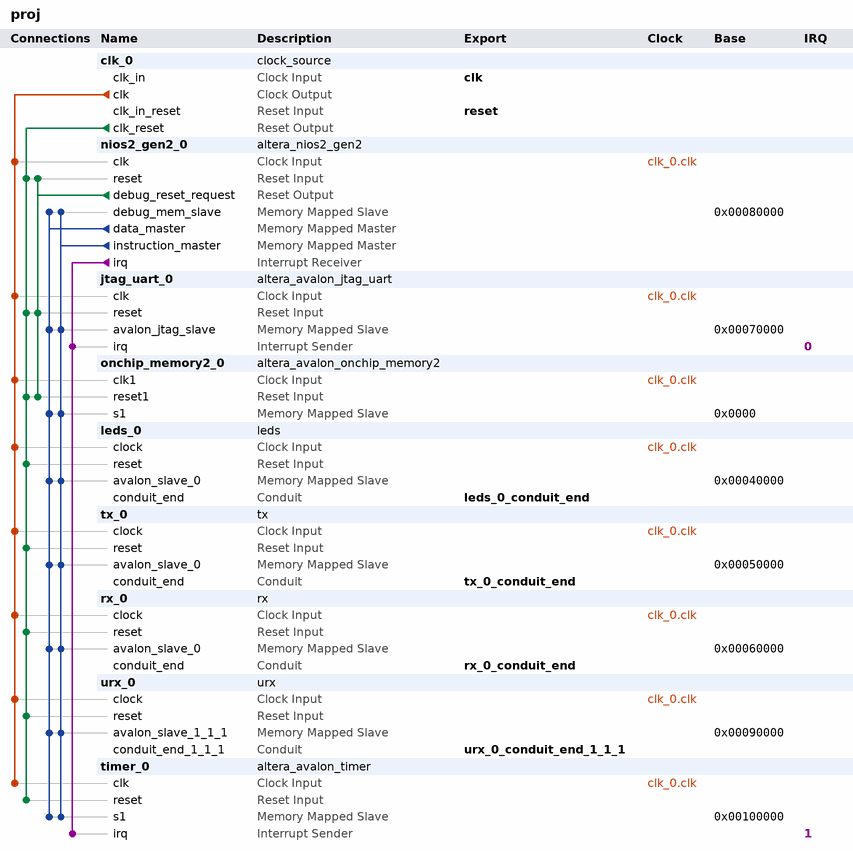
[diagram p0: system contents]
# Platform Designer (Qsys) system proj, Cyclone V 5CEBA4F23C7
# Parameters at their usual value, and those the tool derives, are not listed.
package require -exact qsys 18.1
create_system proj
set_project_property DEVICE_FAMILY {Cyclone V}
set_project_property DEVICE 5CEBA4F23C7

add_instance clk_0 clock_source 18.1
set_instance_parameter_value clk_0 clockFrequency 50000000

add_instance nios2_gen2_0 altera_nios2_gen2 18.1
set_instance_parameter_value nios2_gen2_0 dcache_size 2048
set_instance_parameter_value nios2_gen2_0 exceptionSlave onchip_memory2_0.s1
set_instance_parameter_value nios2_gen2_0 icache_size 4096
set_instance_parameter_value nios2_gen2_0 impl Tiny
set_instance_parameter_value nios2_gen2_0 resetSlave onchip_memory2_0.s1

add_instance jtag_uart_0 altera_avalon_jtag_uart 18.1
set_instance_parameter_value jtag_uart_0 simInteractiveOptions NO_INTERACTIVE_WINDOWS

add_instance onchip_memory2_0 altera_avalon_onchip_memory2 18.1
set_instance_parameter_value onchip_memory2_0 dataWidth 32
set_instance_parameter_value onchip_memory2_0 dualPort false
set_instance_parameter_value onchip_memory2_0 initMemContent true
set_instance_parameter_value onchip_memory2_0 initializationFileName onchip_mem.hex
set_instance_parameter_value onchip_memory2_0 memorySize 262114
set_instance_parameter_value onchip_memory2_0 useNonDefaultInitFile true

add_instance leds_0 leds 1.0

add_instance tx_0 tx 1.0

add_instance rx_0 rx 1.0

add_instance urx_0 urx 1.0

add_instance timer_0 altera_avalon_timer 18.1
set_instance_parameter_value timer_0 period 1
set_instance_parameter_value timer_0 periodUnits MSEC

# connections
add_connection clk_0.clk jtag_uart_0.clk clock
add_connection clk_0.clk leds_0.clock clock
add_connection clk_0.clk nios2_gen2_0.clk clock
add_connection clk_0.clk onchip_memory2_0.clk1 clock
add_connection clk_0.clk rx_0.clock clock
add_connection clk_0.clk timer_0.clk clock
add_connection clk_0.clk tx_0.clock clock
add_connection clk_0.clk urx_0.clock clock
add_connection clk_0.clk_reset jtag_uart_0.reset reset
add_connection clk_0.clk_reset leds_0.reset reset
add_connection clk_0.clk_reset nios2_gen2_0.reset reset
add_connection clk_0.clk_reset onchip_memory2_0.reset1 reset
add_connection clk_0.clk_reset rx_0.reset reset
add_connection clk_0.clk_reset timer_0.reset reset
add_connection clk_0.clk_reset tx_0.reset reset
add_connection clk_0.clk_reset urx_0.reset reset
add_connection nios2_gen2_0.debug_reset_request jtag_uart_0.reset reset
add_connection nios2_gen2_0.debug_reset_request nios2_gen2_0.reset reset
add_connection nios2_gen2_0.debug_reset_request onchip_memory2_0.reset1 reset
add_connection nios2_gen2_0.data_master jtag_uart_0.avalon_jtag_slave avalon
set_connection_parameter_value nios2_gen2_0.data_master/jtag_uart_0.avalon_jtag_slave baseAddress 0x00070000
add_connection nios2_gen2_0.data_master leds_0.avalon_slave_0 avalon
set_connection_parameter_value nios2_gen2_0.data_master/leds_0.avalon_slave_0 baseAddress 0x00040000
add_connection nios2_gen2_0.data_master nios2_gen2_0.debug_mem_slave avalon
set_connection_parameter_value nios2_gen2_0.data_master/nios2_gen2_0.debug_mem_slave baseAddress 0x00080000
add_connection nios2_gen2_0.data_master onchip_memory2_0.s1 avalon
set_connection_parameter_value nios2_gen2_0.data_master/onchip_memory2_0.s1 baseAddress 0x0000
add_connection nios2_gen2_0.data_master rx_0.avalon_slave_0 avalon
set_connection_parameter_value nios2_gen2_0.data_master/rx_0.avalon_slave_0 baseAddress 0x00060000
add_connection nios2_gen2_0.data_master timer_0.s1 avalon
set_connection_parameter_value nios2_gen2_0.data_master/timer_0.s1 baseAddress 0x00100000
add_connection nios2_gen2_0.data_master tx_0.avalon_slave_0 avalon
set_connection_parameter_value nios2_gen2_0.data_master/tx_0.avalon_slave_0 baseAddress 0x00050000
add_connection nios2_gen2_0.data_master urx_0.avalon_slave_1_1_1 avalon
set_connection_parameter_value nios2_gen2_0.data_master/urx_0.avalon_slave_1_1_1 baseAddress 0x00090000
add_connection nios2_gen2_0.instruction_master jtag_uart_0.avalon_jtag_slave avalon
set_connection_parameter_value nios2_gen2_0.instruction_master/jtag_uart_0.avalon_jtag_slave baseAddress 0x00070000
add_connection nios2_gen2_0.instruction_master leds_0.avalon_slave_0 avalon
set_connection_parameter_value nios2_gen2_0.instruction_master/leds_0.avalon_slave_0 baseAddress 0x00040000
add_connection nios2_gen2_0.instruction_master nios2_gen2_0.debug_mem_slave avalon
set_connection_parameter_value nios2_gen2_0.instruction_master/nios2_gen2_0.debug_mem_slave baseAddress 0x00080000
add_connection nios2_gen2_0.instruction_master onchip_memory2_0.s1 avalon
set_connection_parameter_value nios2_gen2_0.instruction_master/onchip_memory2_0.s1 baseAddress 0x0000
add_connection nios2_gen2_0.instruction_master rx_0.avalon_slave_0 avalon
set_connection_parameter_value nios2_gen2_0.instruction_master/rx_0.avalon_slave_0 baseAddress 0x00060000
add_connection nios2_gen2_0.instruction_master timer_0.s1 avalon
set_connection_parameter_value nios2_gen2_0.instruction_master/timer_0.s1 baseAddress 0x00100000
add_connection nios2_gen2_0.instruction_master tx_0.avalon_slave_0 avalon
set_connection_parameter_value nios2_gen2_0.instruction_master/tx_0.avalon_slave_0 baseAddress 0x00050000
add_connection nios2_gen2_0.instruction_master urx_0.avalon_slave_1_1_1 avalon
set_connection_parameter_value nios2_gen2_0.instruction_master/urx_0.avalon_slave_1_1_1 baseAddress 0x00090000
add_connection nios2_gen2_0.irq jtag_uart_0.irq interrupt
set_connection_parameter_value nios2_gen2_0.irq/jtag_uart_0.irq irqNumber 0
add_connection nios2_gen2_0.irq timer_0.irq interrupt
set_connection_parameter_value nios2_gen2_0.irq/timer_0.irq irqNumber 1

# exported interfaces
add_interface clk clock sink
set_interface_property clk EXPORT_OF clk_0.clk_in
add_interface leds_0_conduit_end conduit end
set_interface_property leds_0_conduit_end EXPORT_OF leds_0.conduit_end
add_interface reset reset sink
set_interface_property reset EXPORT_OF clk_0.clk_in_reset
add_interface rx_0_conduit_end conduit end
set_interface_property rx_0_conduit_end EXPORT_OF rx_0.conduit_end
add_interface tx_0_conduit_end conduit end
set_interface_property tx_0_conduit_end EXPORT_OF tx_0.conduit_end
add_interface urx_0_conduit_end_1_1_1 conduit end
set_interface_property urx_0_conduit_end_1_1_1 EXPORT_OF urx_0.conduit_end_1_1_1

set_interconnect_requirement {$system} qsys_mm.clockCrossingAdapter HANDSHAKE
set_interconnect_requirement {$system} qsys_mm.enableEccProtection FALSE
set_interconnect_requirement {$system} qsys_mm.insertDefaultSlave FALSE
set_interconnect_requirement {$system} qsys_mm.maxAdditionalLatency 1

save_system proj.qsys
